# EasyEDA Pro project ProPrj_New Project_2026-07-15_23-14-34_2026-07-27.epro, schematic Schematic1
Board Name: Board1; Create Date: 2026-07-15; Page Name: P1; Project Name: New Project_2026-07-15_23-14-34; Schematic Name: Schematic1; Update Date: 2026-07-15; Company: EasyEDA.com; Page Size: A4; Version: V1.0
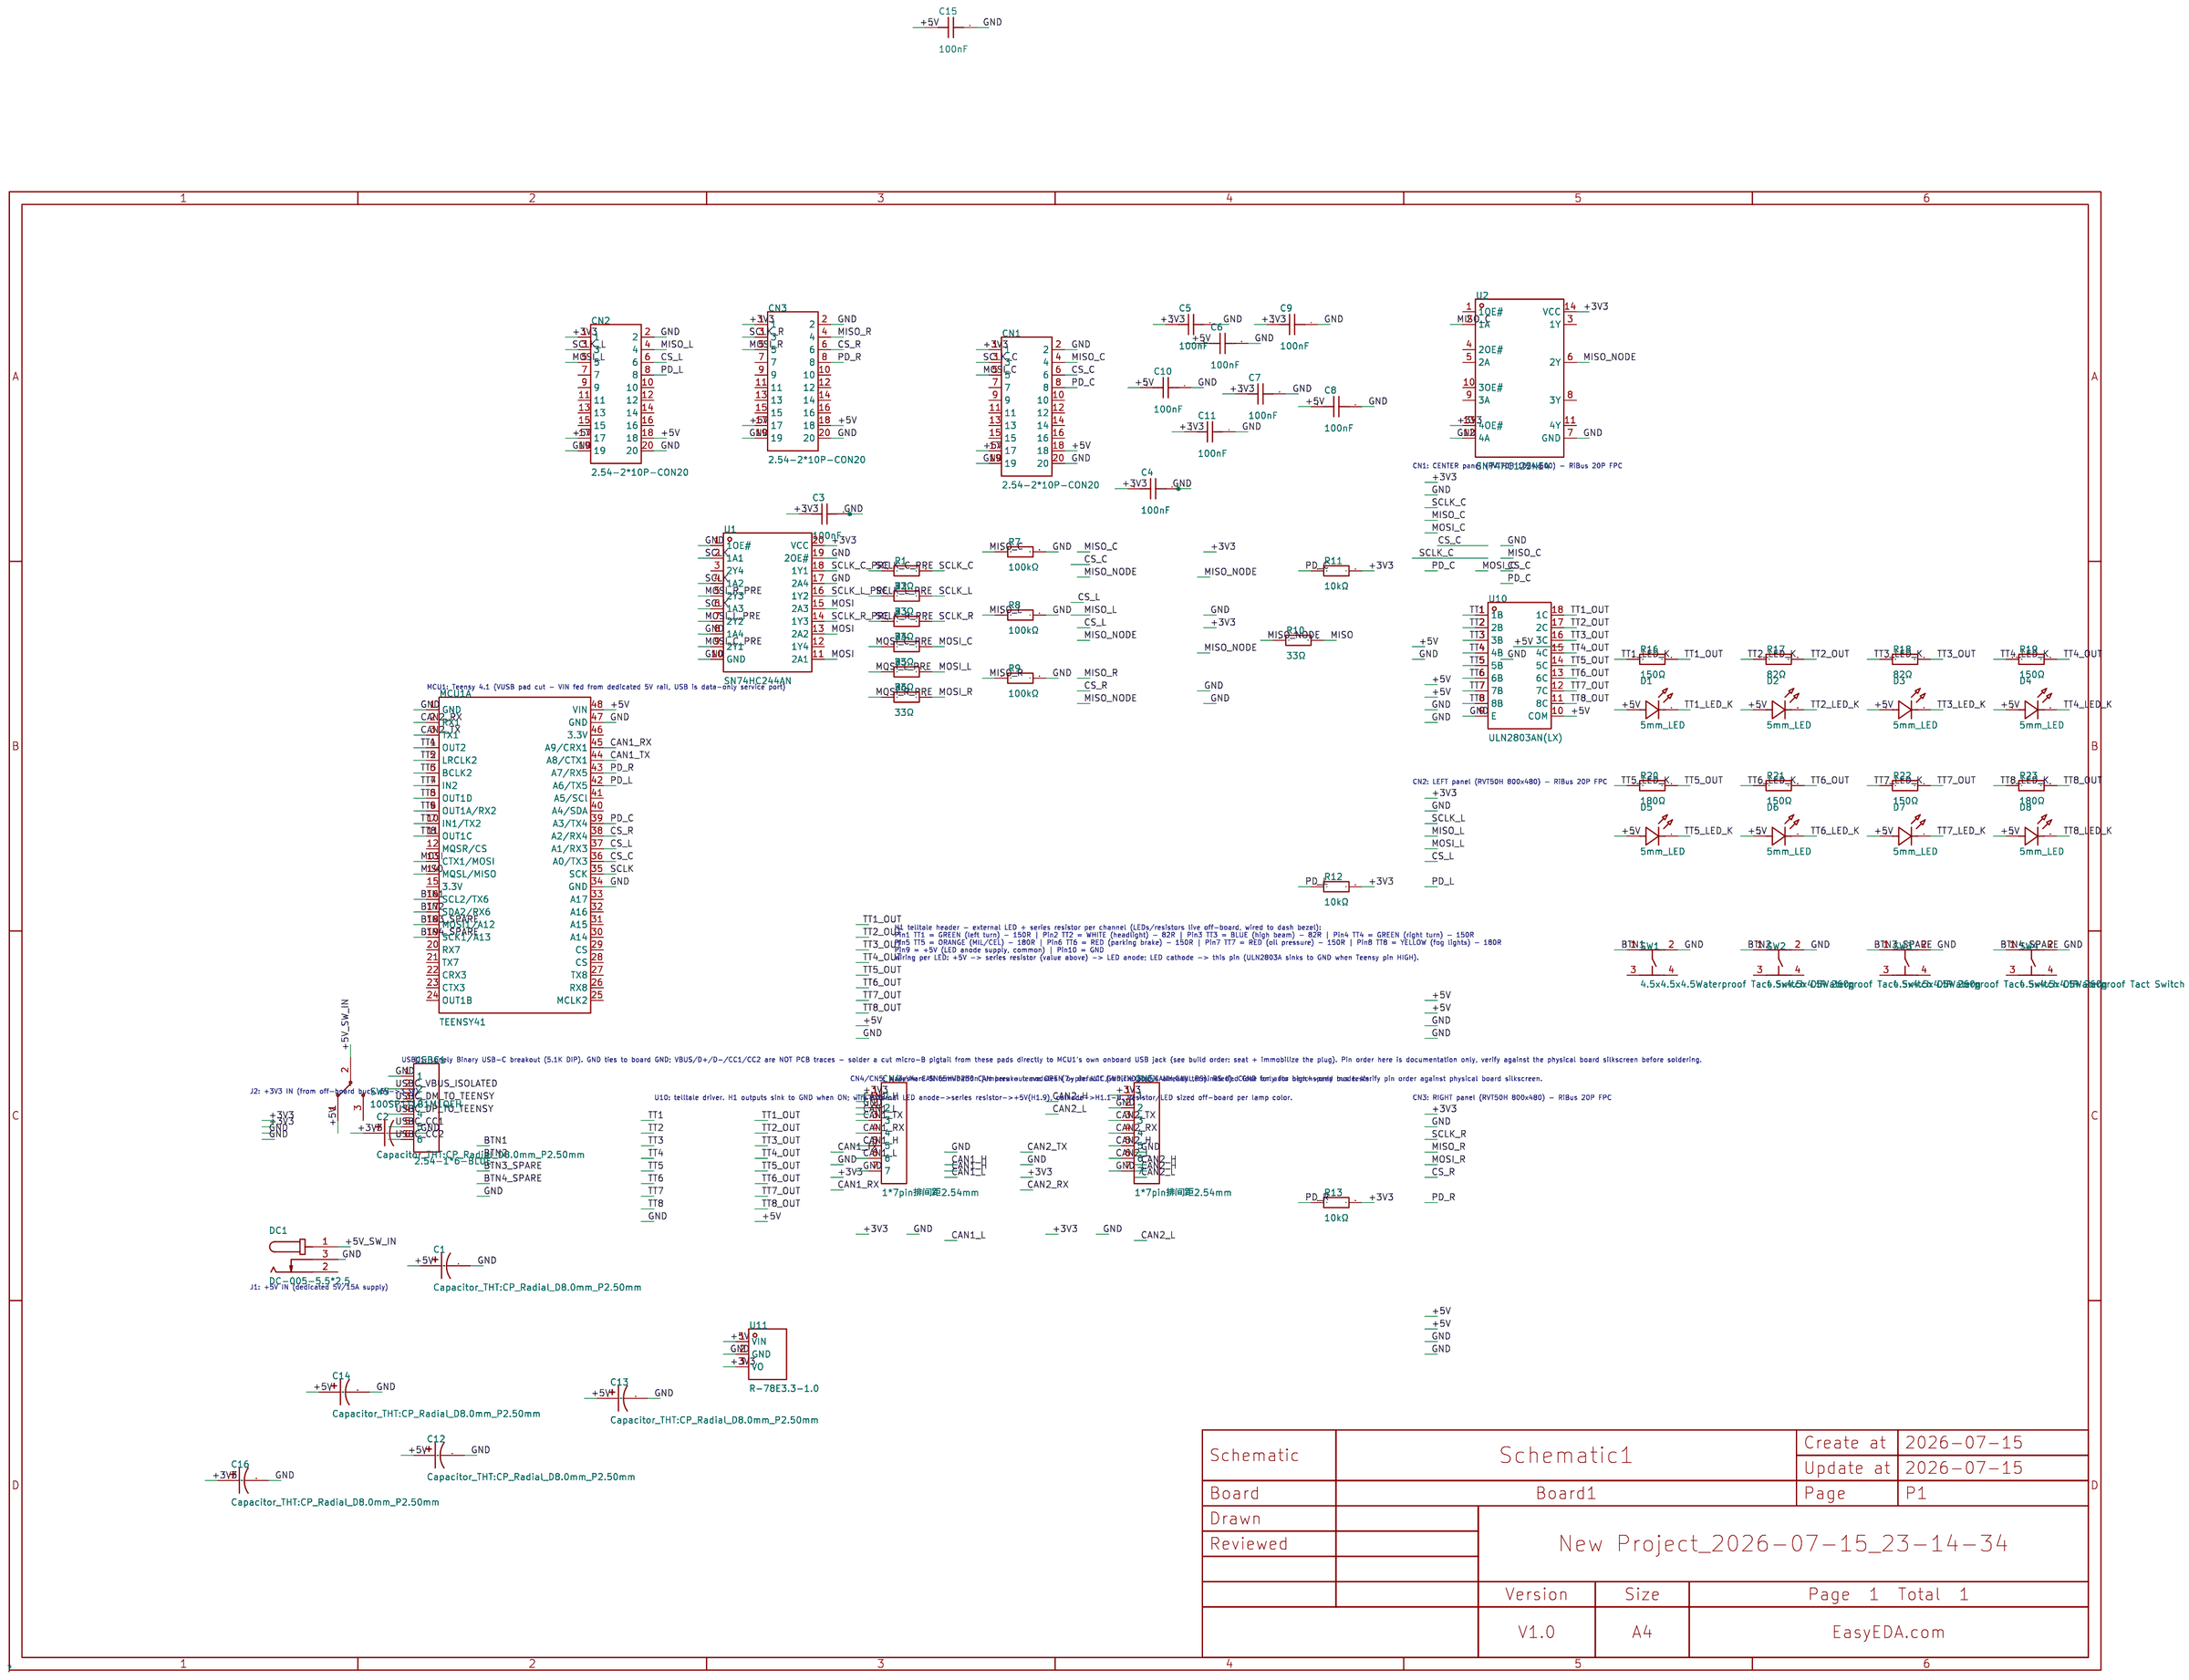
[diagram p2: schematic sheet]

## Parts
C1  10µF  [CAP-TH_BD8.0-P3.50-D0.6-FD]
C2  10µF  [CAP-TH_BD8.0-P3.50-D0.6-FD]
C3  100nF  [CAP-TH_L5.0-W2.5-P5.00-D1.0]
C4  100nF  [CAP-TH_L5.0-W2.5-P5.00-D1.0]
C5  100nF  [CAP-TH_L5.0-W2.5-P5.00-D1.0]
C6  100nF  [CAP-TH_L5.0-W2.5-P5.00-D1.0]
C7  100nF  [CAP-TH_L5.0-W2.5-P5.00-D1.0]
C8  100nF  [CAP-TH_L5.0-W2.5-P5.00-D1.0]
C9  100nF  [CAP-TH_L5.0-W2.5-P5.00-D1.0]
C10  100nF  [CAP-TH_L5.0-W2.5-P5.00-D1.0]
C11  100nF  [CAP-TH_L5.0-W2.5-P5.00-D1.0]
C12  10µF  [CAP-TH_BD8.0-P3.50-D0.6-FD]
C13  10µF  [CAP-TH_BD8.0-P3.50-D0.6-FD]
C14  10µF  [CAP-TH_BD8.0-P3.50-D0.6-FD]
C15  100nF  [CAP-TH_L5.0-W2.5-P5.00-D1.0]
C16  10µF  [CAP-TH_BD8.0-P3.50-D0.6-FD]
CN1  2.54-2*10P-CON20  [HDR-TH_20P-P2.54-V-F-R2-C10-S2.54]
CN2  2.54-2*10P-CON20  [HDR-TH_20P-P2.54-V-F-R2-C10-S2.54]
CN3  2.54-2*10P-CON20  [HDR-TH_20P-P2.54-V-F-R2-C10-S2.54]
CN4  1*7pin排间距2.54mm  [CONN-TH_7P-P2.54_C9900012194]
CN5  1*7pin排间距2.54mm  [CONN-TH_7P-P2.54_C9900012194]
D1  GREEN (left turn)  [LED-TH_BD5.0-P2.54-FD]
D2  WHITE (headlight)  [LED-TH_BD5.0-P2.54-FD]
D3  BLUE (high beam)  [LED-TH_BD5.0-P2.54-FD]
D4  GREEN (right turn)  [LED-TH_BD5.0-P2.54-FD]
D5  ORANGE (MIL/CEL)  [LED-TH_BD5.0-P2.54-FD]
D6  RED (parking brake)  [LED-TH_BD5.0-P2.54-FD]
D7  RED (oil)  [LED-TH_BD5.0-P2.54-FD]
D8  YELLOW (fog lights)  [LED-TH_BD5.0-P2.54-FD]
DC1  DC-005-5.5*2.5  [DC-IN-TH_DC-005-2]
MCU1  TEENSY41  [COMM-TH_L60.1-W17.8-P2.54]  (section 1)
R1  33Ω  [R_AXIAL-0.4]
R2  33Ω  [R_AXIAL-0.4]
R3  33Ω  [R_AXIAL-0.4]
R4  33Ω  [R_AXIAL-0.4]
R5  33Ω  [R_AXIAL-0.4]
R6  33Ω  [R_AXIAL-0.4]
R7  100kΩ  [R_AXIAL-0.4]
R8  100kΩ  [R_AXIAL-0.4]
R9  100kΩ  [R_AXIAL-0.4]
R10  33Ω  [R_AXIAL-0.4]
R11  10kΩ  [R_AXIAL-0.4]
R12  10kΩ  [R_AXIAL-0.4]
R13  10kΩ  [R_AXIAL-0.4]
R16  150Ω  [R_AXIAL-0.4]
R17  82Ω  [R_AXIAL-0.4]
R18  82Ω  [R_AXIAL-0.4]
R19  150Ω  [R_AXIAL-0.4]
R20  180Ω  [R_AXIAL-0.4]
R21  150Ω  [R_AXIAL-0.4]
R22  150Ω  [R_AXIAL-0.4]
R23  180Ω  [R_AXIAL-0.4]
SW1  TACT SW  [SW-TH_4P-L4.5-W4.5-P3.00-LS5.4]
SW2  TACT SW  [SW-TH_4P-L4.5-W4.5-P3.00-LS5.4]
SW3  TACT SW  [SW-TH_4P-L4.5-W4.5-P3.00-LS5.4]
SW4  TACT SW  [SW-TH_4P-L4.5-W4.5-P3.00-LS5.4]
SW5  100SP1T1B1M1QEH  [SW-TH_L12.7-W6.9-P4.70_TOGGLESWITCH7102]
U1  SN74HC244AN  [PDIP-20_L25.9-W6.6-P2.54-LS7.9-BL]
U2  SN74HC125NE4  [PDIP-14_L19.3-W6.4-P2.54-LS9.0-BL]
U10  ULN2803AN(LX)  [DIP-18_L23.0-W6.5-P2.54-LS7.6-BL]
U11  R-78E3.3-1.0  [PWRM-TH_R-78EXX-1.0]
USBC1  2.54-1*6-BLUE  [HDR-TH_6P-P2.54-V-M_BLUE]

## Library data of the parts
C1 C2 C12-C14 C16 = Capacitor_THT:CP_Radial_D8.0mm_P2.50mm: Supplier Part: C9900016268; Supplier Footprint: 470uF_25V; JLCPCB Part Class: Extended Part; Supplier: LCSC
C3-C11 C15 = 100nF: Supplier Part: C9900015256; JLCPCB Part Class: Extended Part; Supplier: LCSC
CN1-CN3 = 2.54-2*10P-CON20: Supplier Part: C9900007750; Supplier Footprint: CON20; JLCPCB Part Class: Extended Part; Supplier: LCSC
CN4 CN5 = 1*7pin排间距2.54mm: Supplier Part: C9900012194; Supplier Footprint: 插件; JLCPCB Part Class: Extended Part; Supplier: LCSC
D1-D8 = 5mm_LED: Supplier Part: C9900148483; Supplier Footprint: DIP; Supplier: LCSC
DC1 = DC-005-5.5*2.5: Supplier Part: C9900017043; Supplier Footprint: DC-005; JLCPCB Part Class: Extended Part; Supplier: LCSC
MCU1 = TEENSY41: Supplier Part: C9900133442; Supplier Footprint: SMD; Supplier: LCSC
R1-R13 R16-R23 = Res_AXIAL-1/4W: Supplier Footprint: Through; Supplier Part: 电阻.1
SW1-SW4 = 4.5x4.5x4.5Waterproof Tact Switch DIP 260g: LCSC Part Name: 4.5x4.5x4.5防水插件轻触开关260g; Supplier Part: C39832248; Manufacturer: CAX(创都); Supplier Footprint: DIP-4P,4.5x4.5mm; Datasheet: https://atta.szlcsc.com/upload/public/pdf/source/20240809/87BC5FA876BA79D376E205D58434F11F.pdf; Supplier: LCSC
SW5 = 100SP1T1B1M1QEH: Circuit:SPDT Length:12.7mm Width:6.86mm Switch Height:28.19mm Life:50,000 times Current Rating:5A Voltage Rating (AC):120V Voltage Rating (DC):28V Actuator Type:Cylinder knob Termination Style:Solder Lug Mounting Type:Straight Operating Temperature:-30℃~+; LCSC Part Name: 五件套 100SP1T1B1M1QEH; Supplier Part: C273350; Manufacturer: E-Switch; Supplier Footprint: 插件; JLCPCB Part Class: Extended Part; Datasheet: https://item.szlcsc.com/datasheet/100SP1T1B1M1QEH/261633.html; Supplier: LCSC; Circuit: SPDT; Length: 12.7mm; Width: 6.86mm; Switch Height: 28.19mm; Life: 50,000 times; Current Rating: 5A; Voltage Rating (AC): 120V; Voltage Rating (DC): 28V; Actuator Type: Cylinder knob; Termination Style: Solder Lug; Mounting Type: Straight; Operating Temperature: -30℃~+85℃
U1 = SN74HC244AN: output type:Tri-State Voltage - Supply:2V~6V Voltage - Supply:2V~6V Number of Elements:2 Number of Bits per Element:4 Current - Output Low(IOL):7.8mA Current - Output High(IOH):7.8mA Logic Family:74HC Operating Temperature:-40℃~+85℃ Operating Temperature:; Supplier Part: C17648033; Manufacturer: TI(德州仪器); Supplier Footprint: PDIP-20; JLCPCB Part Class: Extended Part; Supplier: LCSC; output type: Tri-State; Voltage - Supply: 2V~6V; Number of Elements: 2; Number of Bits per Element: 4; Current - Output Low(IOL): 7.8mA; Current - Output High(IOH): 7.8mA; Logic Family: 74HC; Operating Temperature: -40℃~+85℃
U2 = SN74HC125NE4: Input type:StandardCMOS output type:Tri-State Voltage - Supply:2V~6V Voltage - Supply:2V~6V Number of Elements:4 Number of Bits per Element:1 Channel Type:Unidirectional Current - Output Low(IOL):7.8mA Current - Output High(IOH):7.8mA Logic Family:74HC Op; Supplier Part: C6489174; Manufacturer: TI(德州仪器); Supplier Footprint: PDIP-14; JLCPCB Part Class: Extended Part; Datasheet: https://item.szlcsc.com/datasheet/SN74HC125NE4/7442358.html; Supplier: LCSC; Input type: StandardCMOS; output type: Tri-State; Voltage - Supply: 2V~6V; Number of Elements: 4; Number of Bits per Element: 1; Channel Type: Unidirectional; Current - Output Low(IOL): 7.8mA; Current - Output High(IOH): 7.8mA; Logic Family: 74HC; Operating Temperature: -40℃~+85℃; Quiescent Current: 80uA; Propagation Delay: 39ns@6V,150pF
U10 = ULN2803AN(LX): number of channels:8 Collector - Emitter Voltage VCEO:50V Current - Collector(Ic):- Voltage - Input(Max):24V Operating Temperature:-40℃~+85℃ Operating Temperature:-40℃~+85℃ Vce Saturation(VCE(sat)):1.3V@500uA,350mA Input Current(on):0.4mA Input Current(of; LCSC Part Name: 八路达林顿晶体管阵列; Supplier Part: C32710671; Manufacturer: LX(灵星芯微); Supplier Footprint: DIP-18; JLCPCB Part Class: Extended Part; Datasheet: https://item.szlcsc.com/datasheet/ULN2803AN(LX)/34444190.html; Supplier: LCSC; number of channels: 8; Collector - Emitter Voltage VCEO: 50V; Voltage - Input(Max): 24V; Operating Temperature: -40℃~+85℃; Vce Saturation(VCE(sat)): 1.3V@500uA,350mA; Input Current(on): 0.4mA; Input Current(off): 65uA; Voltage - Forward(Vf): 2V; Input Capacitiance(Ci): 15pF
U11 = R-78E3.3-1.0: Type:- Function:Step-down type Number of Outputs:1 Voltage - Supply:6V~36V Voltage - Supply:6V~36V Conversion Efficiency:90% Conversion Efficiency:90% Output Voltage:3.3V Output Voltage:3.3V Output Voltage Accuracy:±3% Output Voltage Accuracy:±3% Output C; LCSC Part Name: DC/DC电源模块宽压输入非隔离稳压输出; Supplier Part: C22371889; Manufacturer: YLPTEC(易川); Supplier Footprint: SIP,11.6x7.5mm; JLCPCB Part Class: Extended Part; Datasheet: https://item.szlcsc.com/datasheet/R-78E3.3-1.0/23862551.html; Supplier: LCSC; Function: Step-down type; Number of Outputs: 1; Voltage - Supply: 6V~36V; Conversion Efficiency: 90%; Output Voltage: 3.3V; Output Voltage Accuracy: ±3%; Output Current(Max): 1A; Quiescent Supply Current: 300uA; Ripple Noise: 50mVp-p; Switching Frequency: 850kHz; Capacitive Load(Max): 2200uF; Operating Temperature Range: -40℃~+85℃; Length: 11.6mm; Width: 7.5mm; Height: 10.2mm; Features: Short Circuit Protection；Automatic fault recovery
USBC1 = 2.54-1*6-BLUE: Supplier Part: C9900192756; Supplier Footprint: 排针插件,P=2.54mm-蓝色; JLCPCB Part Class: Extended Part; Supplier: LCSC

## Nets
+3V3: C2.1 C3.2 C4.2 C5.2 C7.2 C9.2 C11.2 C16.1 CN1.1 CN2.1 CN3.1 CN4.1 CN5.1 R11.2 R12.2 R13.2 U1.20(VCC) U2.13(4OE#) U2.14(VCC) U11.3(VO)
+5V: C1.1 C6.2 C8.2 C10.2 C12.1 C13.1 C14.1 C15.2 CN1.17 CN1.18 CN2.17 CN2.18 CN3.17 CN3.18 D1.1(A) D2.1(A) D3.1(A) D4.1(A) D5.1(A) D6.1(A) D7.1(A) D8.1(A) MCU1.48(VIN) SW5.1 U10.10(COM) U11.1(VIN)
+5V_SW_IN: DC1.1 SW5.2
GND: C1.2 C2.2 C3.1 C4.1 C5.1 C6.1 C7.1 C8.1 C9.1 C10.1 C11.1 C12.2 C13.2 C14.2 C15.1 C16.2 CN1.2 CN1.19 CN1.20 CN2.2 CN2.19 CN2.20 CN3.2 CN3.19 CN3.20 CN4.2 CN4.7 CN5.2 CN5.7 DC1.3 MCU1.1(GND) MCU1.34(GND) MCU1.47(GND) R7.2 R8.2 R9.2 SW1.2 SW2.2 SW3.2 SW4.2 U1.1(1OE#) U1.8(1A4) U1.10(GND) U1.17(2A4) U1.19(2OE#) U2.7(GND) U2.12(4A) U10.9(E) U11.2(GND) USBC1.1
BTN1: MCU1.16(SCL2/TX6) SW1.1
BTN2: MCU1.17(SDA2/RX6) SW2.1
BTN3_SPARE: MCU1.18(MOSI1/A12) SW3.1
BTN4_SPARE: MCU1.19(SCK1/A13) SW4.1
CAN1_H: CN4.5
CAN1_L: CN4.6
CAN1_RX: CN4.4 MCU1.45(A9/CRX1)
CAN1_TX: CN4.3 MCU1.44(A8/CTX1)
CAN2_H: CN5.5
CAN2_L: CN5.6
CAN2_RX: CN5.4 MCU1.2(RX1)
CAN2_TX: CN5.3 MCU1.3(TX1)
CS_C: CN1.6 MCU1.36(A0/TX3)
CS_L: CN2.6 MCU1.37(A1/RX3)
CS_R: CN3.6 MCU1.38(A2/RX4)
MISO: MCU1.14(MQSL/MISO) R10.2
MISO_C: CN1.4 R7.1 U2.2(1A)
MISO_L: CN2.4 R8.1
MISO_NODE: R10.1 U2.6(2Y)
MISO_R: CN3.4 R9.1
MOSI: MCU1.13(CTX1/MOSI) U1.11(2A1) U1.13(2A2) U1.15(2A3)
MOSI_C: CN1.5 R4.2
MOSI_C_PRE: R4.1 U1.9(2Y1)
MOSI_L: CN2.5 R5.2
MOSI_L_PRE: R5.1 U1.7(2Y2)
MOSI_R: CN3.5 R6.2
MOSI_R_PRE: R6.1 U1.5(2Y3)
PD_C: CN1.8 MCU1.39(A3/TX4) R11.1
PD_L: CN2.8 MCU1.42(A6/TX5) R12.1
PD_R: CN3.8 MCU1.43(A7/RX5) R13.1
SCLK: MCU1.35(SCK) U1.2(1A1) U1.4(1A2) U1.6(1A3)
SCLK_C: CN1.3 R1.2
SCLK_C_PRE: R1.1 U1.18(1Y1)
SCLK_L: CN2.3 R2.2
SCLK_L_PRE: R2.1 U1.16(1Y2)
SCLK_R: CN3.3 R3.2
SCLK_R_PRE: R3.1 U1.14(1Y3)
TT1: MCU1.4(OUT2) U10.1(1B)
TT1_LED_K: D1.2(K) R16.1
TT1_OUT: R16.2 U10.18(1C)
TT2: MCU1.5(LRCLK2) U10.2(2B)
TT2_LED_K: D2.2(K) R17.1
TT2_OUT: R17.2 U10.17(2C)
TT3: MCU1.6(BCLK2) U10.3(3B)
TT3_LED_K: D3.2(K) R18.1
TT3_OUT: R18.2 U10.16(3C)
TT4: MCU1.7(IN2) U10.4(4B)
TT4_LED_K: D4.2(K) R19.1
TT4_OUT: R19.2 U10.15(4C)
TT5: MCU1.8(OUT1D) U10.5(5B)
TT5_LED_K: D5.2(K) R20.1
TT5_OUT: R20.2 U10.14(5C)
TT6: MCU1.9(OUT1A/RX2) U10.6(6B)
TT6_LED_K: D6.2(K) R21.1
TT6_OUT: R21.2 U10.13(6C)
TT7: MCU1.10(IN1/TX2) U10.7(7B)
TT7_LED_K: D7.2(K) R22.1
TT7_OUT: R22.2 U10.12(7C)
TT8: MCU1.11(OUT1C) U10.8(8B)
TT8_LED_K: D8.2(K) R23.1
TT8_OUT: R23.2 U10.11(8C)
USBC_CC1: USBC1.5
USBC_CC2: USBC1.6
USBC_DM_TO_TEENSY: USBC1.3
USBC_DP_TO_TEENSY: USBC1.4
USBC_VBUS_ISOLATED: USBC1.2

Not connected (* = marked no-connect by the designer): CN1 7 9 10 11 12 13 14 15 16; CN2 7 9 10 11 12 13 14 15 16; CN3 7 9 10 11 12 13 14 15 16; DC1 2; MCU1 12(MQSR/CS) 15(3.3V) 20(RX7) 21(TX7) 22(CRX3) 23(CTX3) 24(OUT1B) 25(MCLK2) 26(RX8) 27(TX8) 28(CS) 29(CS) 30(A14) 31(A15) 32(A16) 33(A17) 40(A4/SDA) 41(A5/SCl) 46(3.3V); SW1 3 4; SW2 3 4; SW3 3 4; SW4 3 4; SW5 3; U1 3(2Y4) 12(1Y4); U2 1(1OE#) 3(1Y) 4(2OE#) 5(2A) 8(3Y) 9(3A) 10(3OE#) 11(4Y)

## Notes on the sheet
- CN1: CENTER panel (RVT70H 1024x600) - RiBus 20P FPC
- MCU1: Teensy 4.1 (VUSB pad cut - VIN fed from dedicated 5V rail, USB is data-only service port)
- CN2: LEFT panel (RVT50H 800x480) - RiBus 20P FPC
- H1 telltale header - external LED + series resistor per channel (LEDs/resistors live off-board, wired to dash bezel):
  Pin1 TT1 = GREEN (left turn) - 150R | Pin2 TT2 = WHITE (headlight) - 82R | Pin3 TT3 = BLUE (high beam) - 82R | Pin4 TT4 = GREEN (right turn) - 150R
  Pin5 TT5 = ORANGE (MIL/CEL) - 180R | Pin6 TT6 = RED (parking brake) - 150R | Pin7 TT7 = RED (oil pressure) - 150R | Pin8 TT8 = YELLOW (fog lights) - 180R
  Pin9 = +5V (LED anode supply, common) | Pin10 = GND
  Wiring per LED: +5V -> series resistor (value above) -> LED anode; LED cathode -> this pin (ULN2803A sinks to GND when Teensy pin HIGH).
- USBC1: Lonely Binary USB-C breakout (5.1K DIP). GND ties to board GND; VBUS/D+/D-/CC1/CC2 are NOT PCB traces - solder a cut micro-B pigtail from these pads directly to MCU1's own onboard USB jack (see build order: seat + immobilize the plug). Pin order here is documentation only, verify against the physical board silkscreen before soldering.
- J2: +3V3 IN (from off-board buck, 5V->3.3V)
- CN4/CN5: Waveshare SN65HVD230 CAN breakout modules (7-pin: VCC,GND,TXD,RXD,CANH,CANL,RS). RS tied GND for auto high-speed mode. Verify pin order against physical board silkscreen.
- J3/J4: CAN termination jumpers - leave OPEN by default (vehicle bus is already terminated). Close only for bench-only bus tests.
- U10: telltale driver. H1 outputs sink to GND when ON; wire external LED anode->series resistor->+5V(H1.9), cathode->H1.1-8. Resistor/LED sized off-board per lamp color.
- CN3: RIGHT panel (RVT50H 800x480) - RiBus 20P FPC
- J1: +5V IN (dedicated 5V/15A supply)
